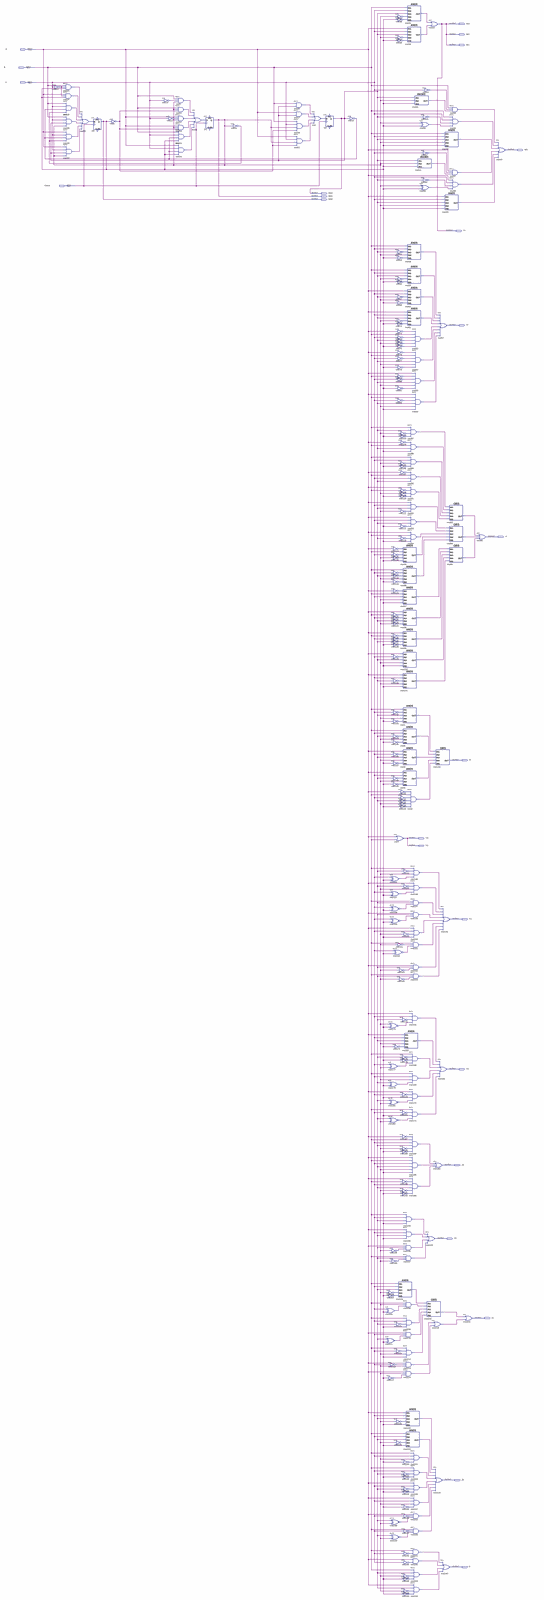
[diagram p0: schematic sheet, whole]
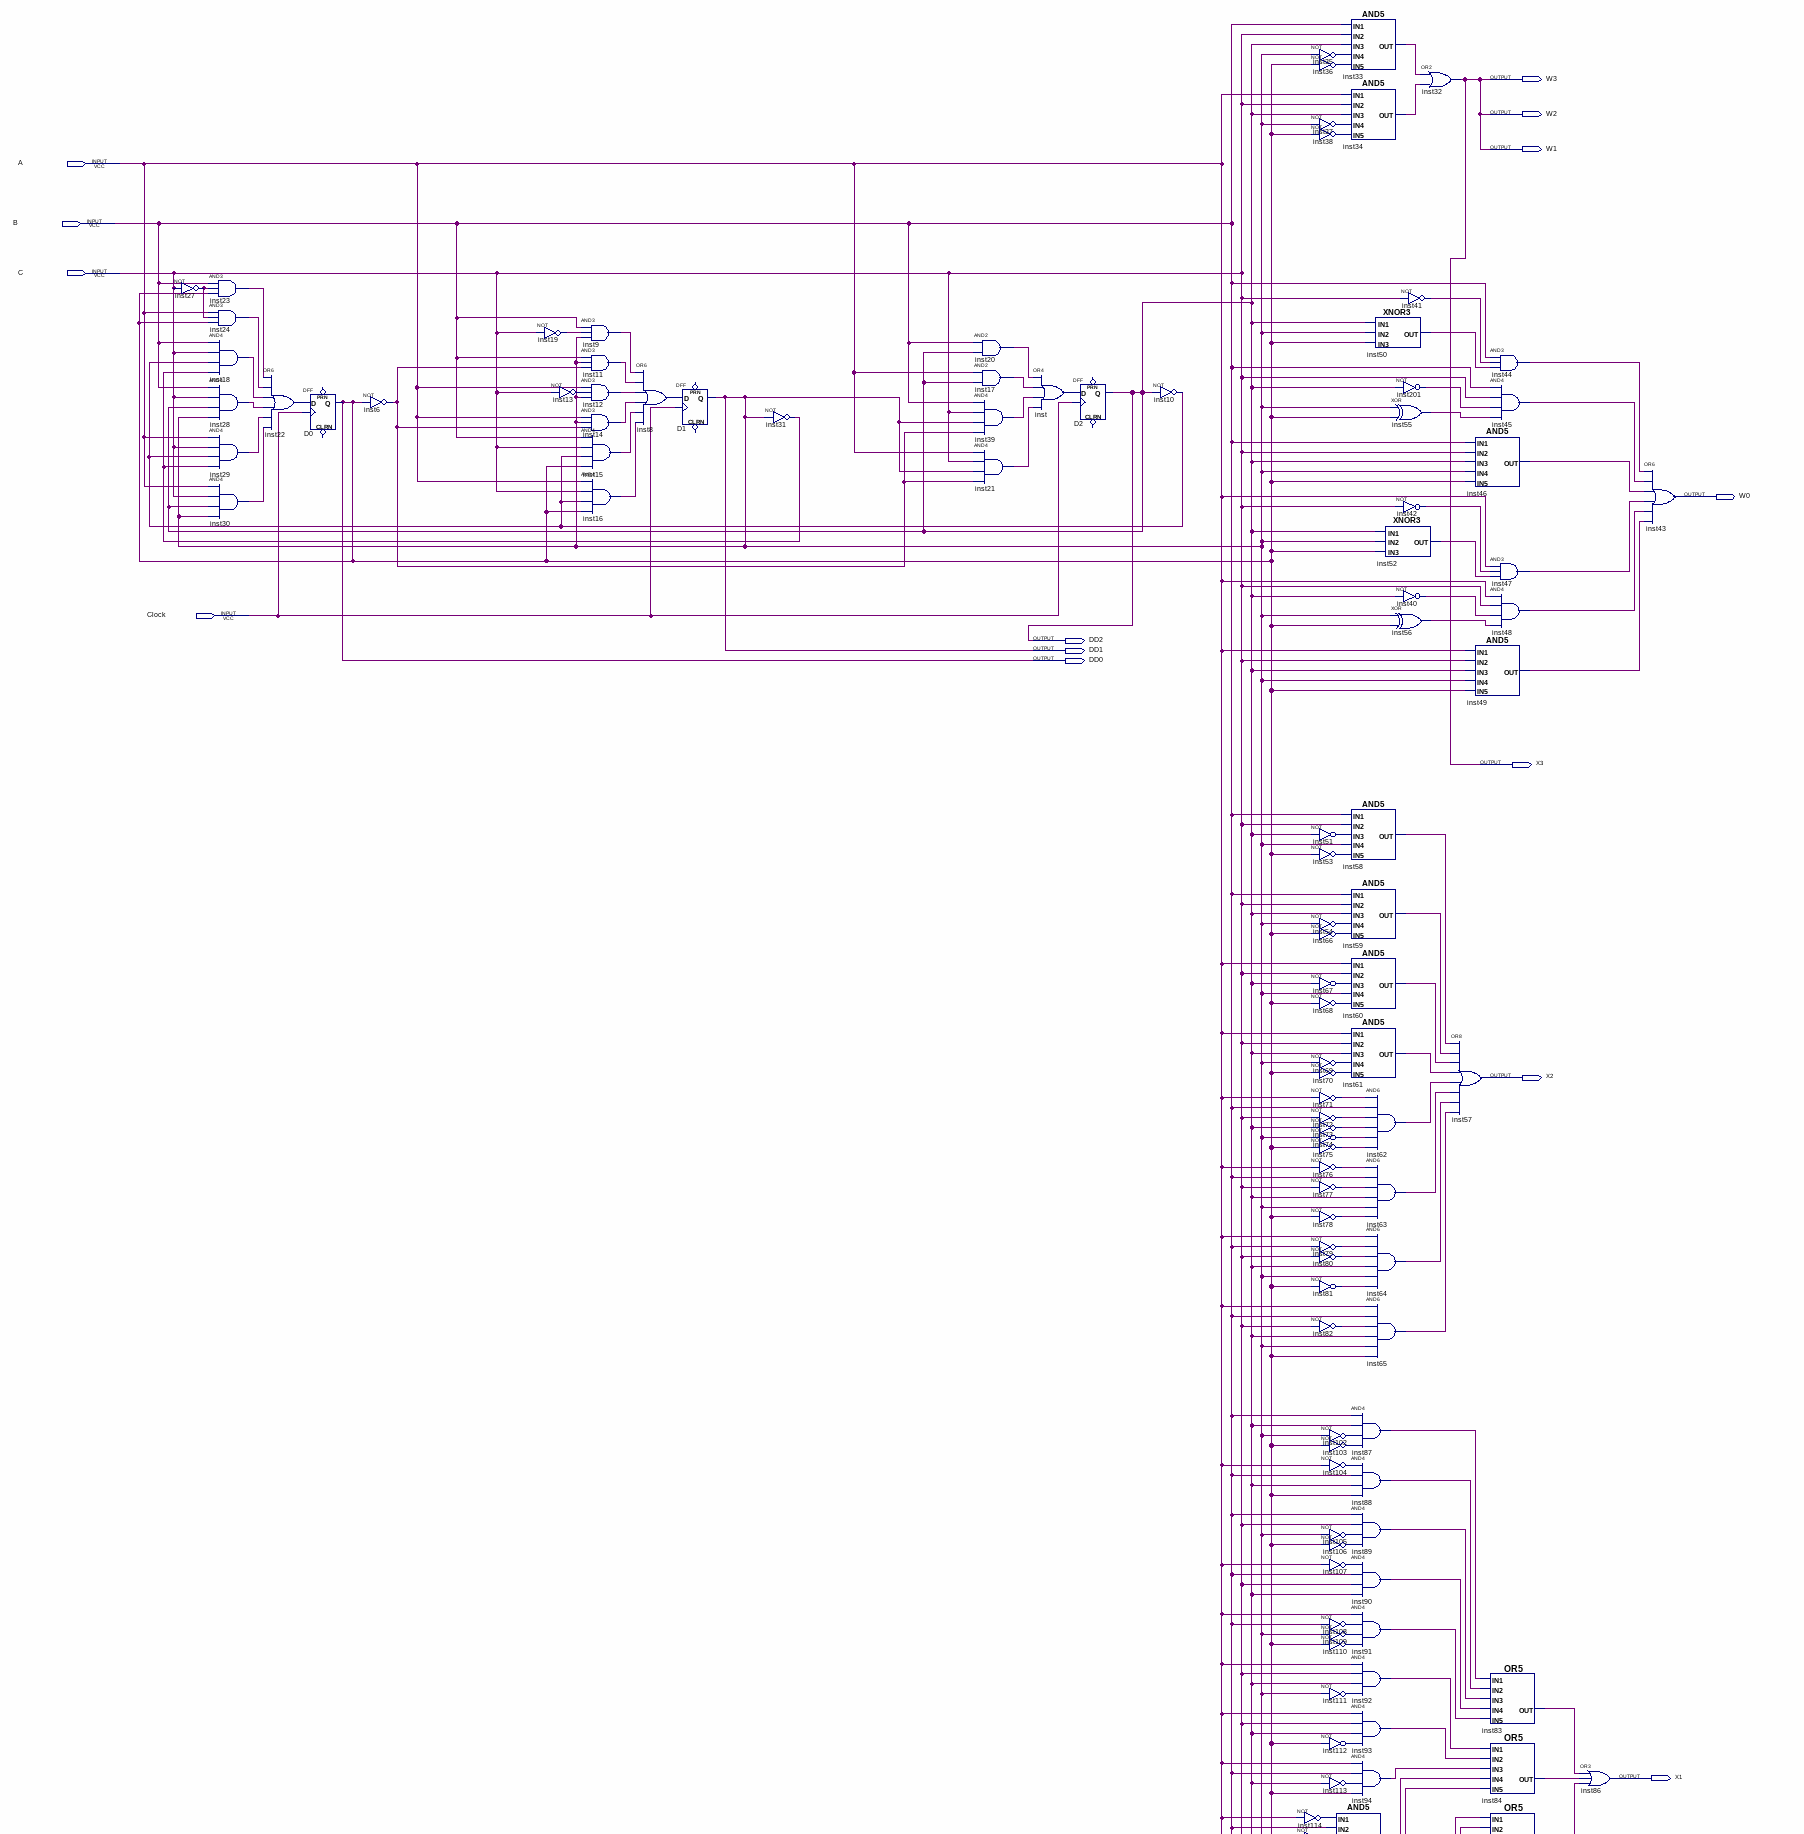
[diagram p1: schematic sheet, upper part]
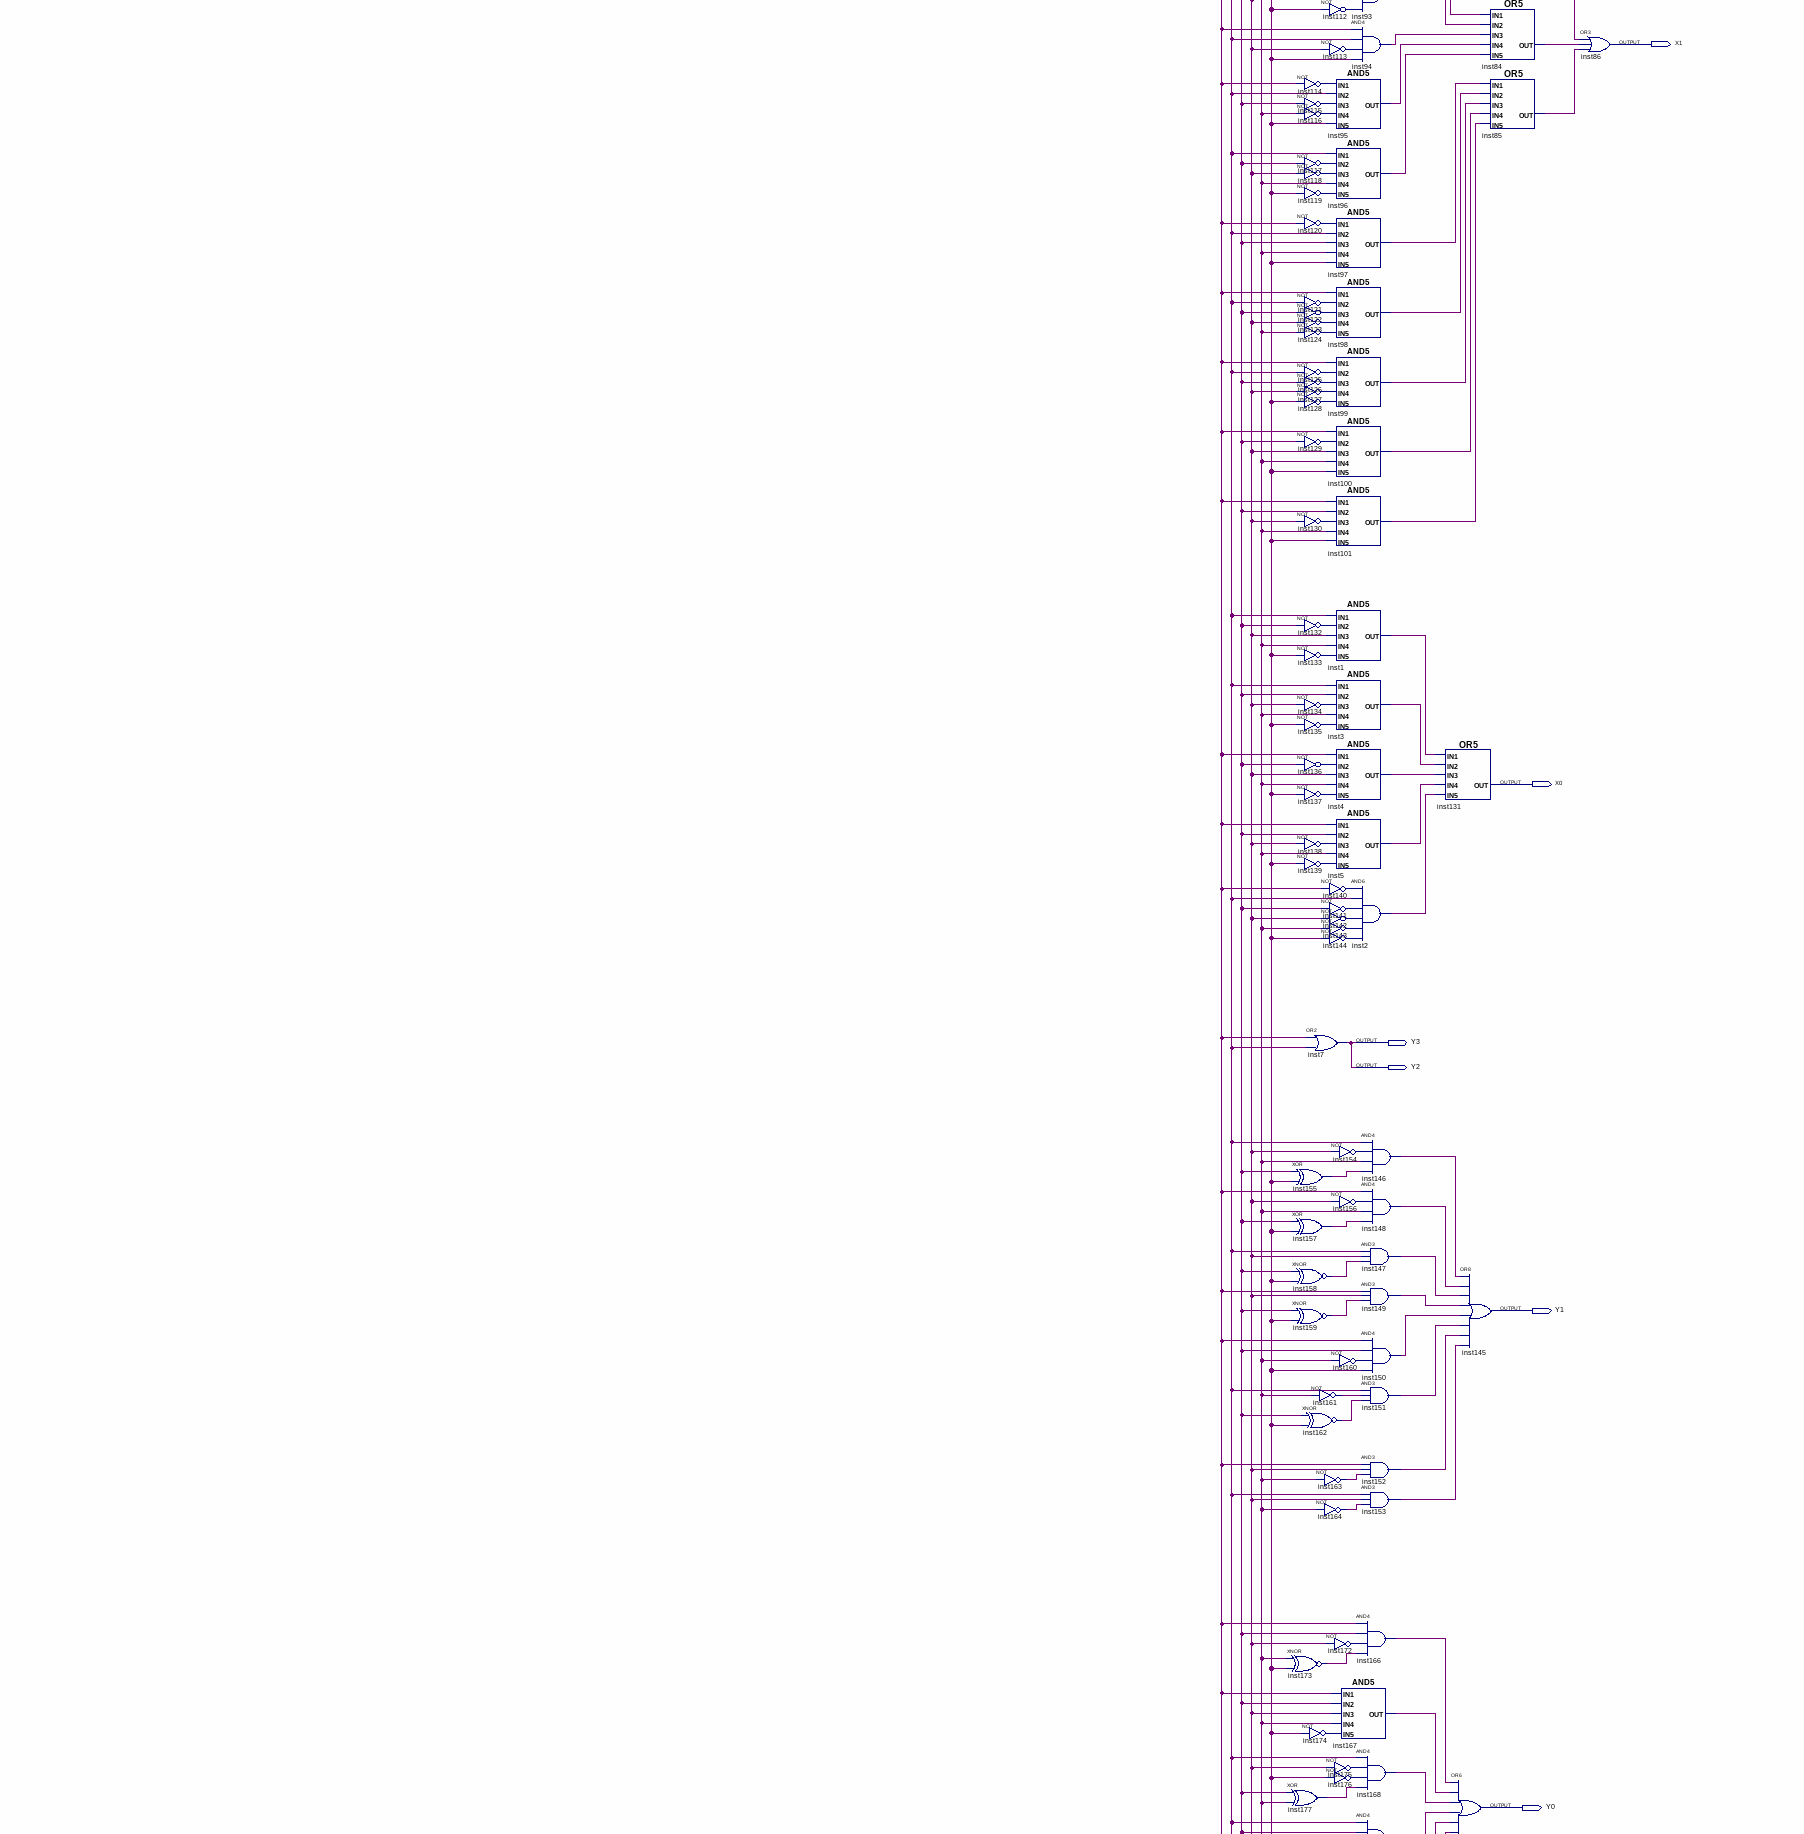
[diagram p2: schematic sheet, middle part]
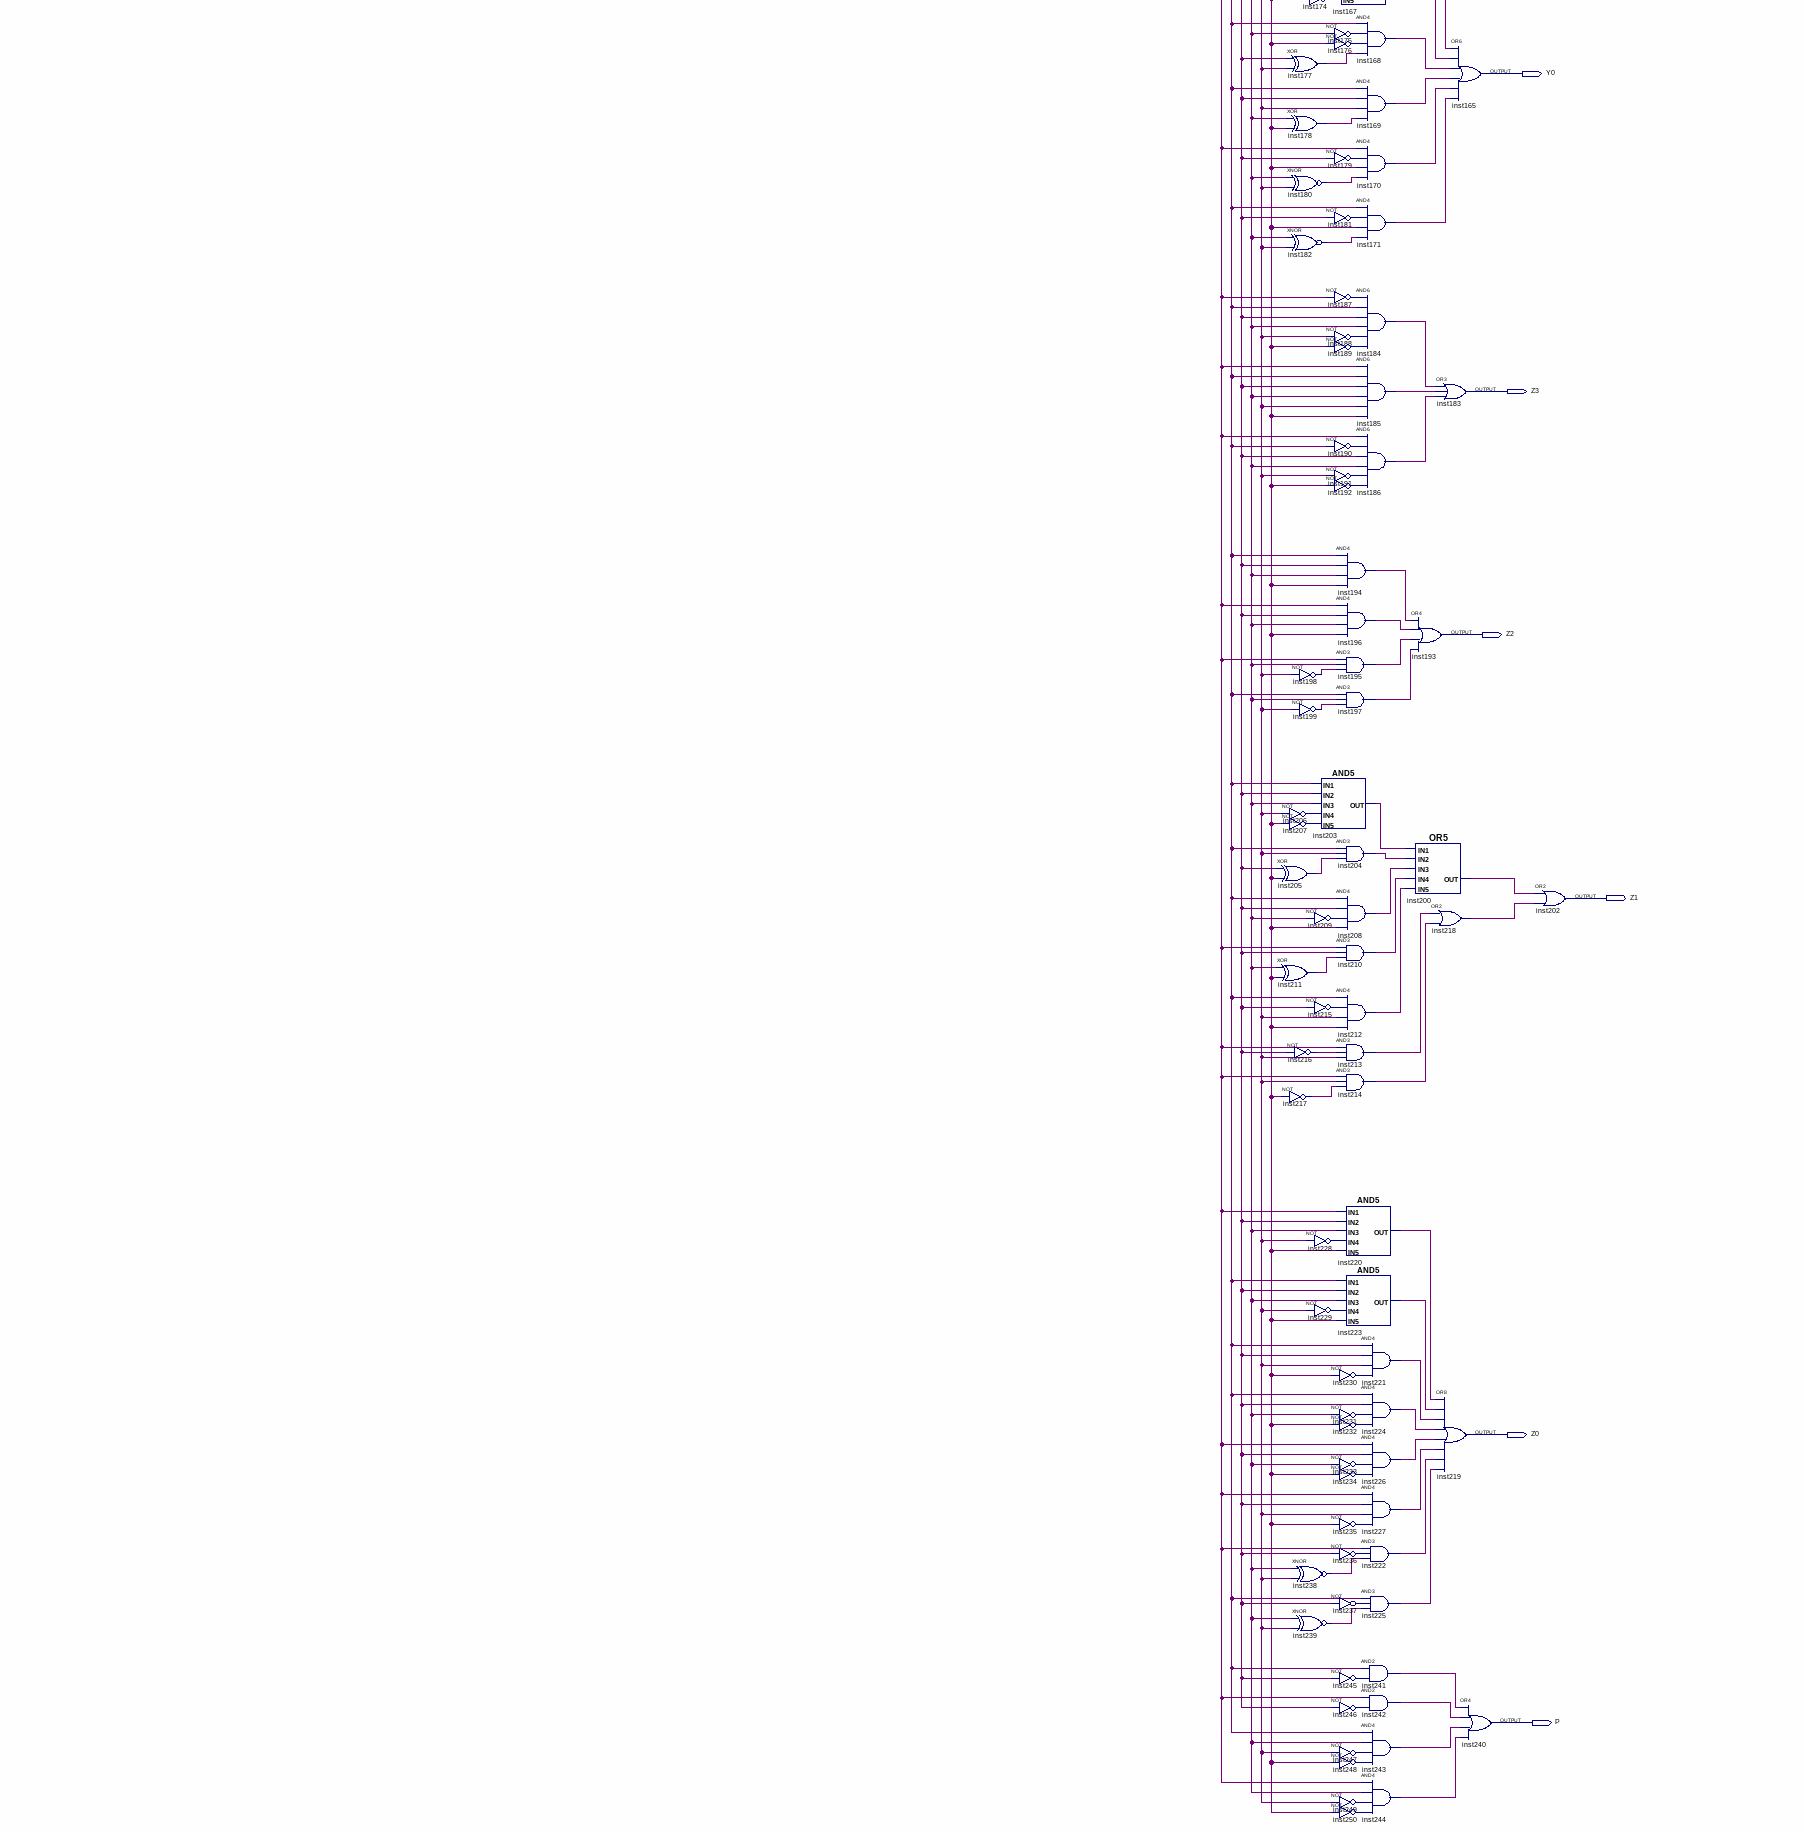
[diagram p3: schematic sheet, lower part]
// Quartus schematic MaquinaEstados.bdf as structural Verilog: 252 symbols, 24 pins
module MaquinaEstados (
  input  A,
  input  B,
  input  C,
  input  Clock,
  output W3,
  output W2,
  output W1,
  output W0,
  output DD2,
  output DD1,
  output DD0,
  output X3,
  output X2,
  output X1,
  output X0,
  output Y3,
  output Y2,
  output Y1,
  output Y0,
  output Z3,
  output Z2,
  output Z1,
  output Z0,
  output P
);

  wire inst1_out, inst2_out, inst3_out, inst4_out, inst5_out, inst6_out, inst8_out, inst9_out, inst10_out,
       inst11_out, inst12_out, inst13_out, inst14_out, inst15_out, inst16_out, inst17_out, inst18_out,
       inst19_out, inst20_out, inst21_out, inst22_out, inst23_out, inst24_out, inst27_out, inst28_out,
       inst29_out, inst30_out, inst31_out, inst33_out, inst34_out, inst35_out, inst36_out, inst37_out,
       inst38_out, inst39_out, inst40_out, inst41_out, inst42_out, inst44_out, inst45_out, inst46_out,
       inst47_out, inst48_out, inst49_out, inst50_out, inst51_out, inst52_out, inst53_out, inst54_out,
       inst55_out, inst56_out, inst58_out, inst59_out, inst60_out, inst61_out, inst62_out, inst63_out,
       inst64_out, inst65_out, inst66_out, inst67_out, inst68_out, inst69_out, inst70_out, inst71_out,
       inst72_out, inst73_out, inst74_out, inst75_out, inst76_out, inst77_out, inst78_out, inst79_out,
       inst80_out, inst81_out, inst82_out, inst83_out, inst84_out, inst85_out, inst87_out, inst88_out,
       inst89_out, inst90_out, inst91_out, inst92_out, inst93_out, inst94_out, inst95_out, inst96_out,
       inst97_out, inst98_out, inst99_out, inst100_out, inst101_out, inst102_out, inst103_out, inst104_out,
       inst105_out, inst106_out, inst107_out, inst108_out, inst109_out, inst110_out, inst111_out,
       inst112_out, inst113_out, inst114_out, inst115_out, inst116_out, inst117_out, inst118_out,
       inst119_out, inst120_out, inst121_out, inst122_out, inst123_out, inst124_out, inst125_out,
       inst126_out, inst127_out, inst128_out, inst129_out, inst130_out, inst132_out, inst133_out,
       inst134_out, inst135_out, inst136_out, inst137_out, inst138_out, inst139_out, inst140_out,
       inst141_out, inst142_out, inst143_out, inst144_out, inst146_out, inst147_out, inst148_out,
       inst149_out, inst150_out, inst151_out, inst152_out, inst153_out, inst154_out, inst155_out,
       inst156_out, inst157_out, inst158_out, inst159_out, inst160_out, inst161_out, inst162_out,
       inst163_out, inst164_out, inst166_out, inst167_out, inst168_out, inst169_out, inst170_out,
       inst171_out, inst172_out, inst173_out, inst174_out, inst175_out, inst176_out, inst177_out,
       inst178_out, inst179_out, inst180_out, inst181_out, inst182_out, inst184_out, inst185_out,
       inst186_out, inst187_out, inst188_out, inst189_out, inst190_out, inst191_out, inst192_out,
       inst194_out, inst195_out, inst196_out, inst197_out, inst198_out, inst199_out, inst200_out,
       inst201_out, inst203_out, inst204_out, inst205_out, inst206_out, inst207_out, inst208_out,
       inst209_out, inst210_out, inst211_out, inst212_out, inst213_out, inst214_out, inst215_out,
       inst216_out, inst217_out, inst218_out, inst220_out, inst221_out, inst222_out, inst223_out,
       inst224_out, inst225_out, inst226_out, inst227_out, inst228_out, inst229_out, inst230_out,
       inst231_out, inst232_out, inst233_out, inst234_out, inst235_out, inst236_out, inst237_out,
       inst238_out, inst239_out, inst241_out, inst242_out, inst243_out, inst244_out, inst245_out,
       inst246_out, inst247_out, inst248_out, inst249_out, inst250_out, inst_out;

  not inst27 (inst27_out, C);
  and inst23 (inst23_out, B, inst27_out, DD0);
  and inst24 (inst24_out, A, inst27_out, DD0);
  and inst18 (inst18_out, B, C, inst10_out, inst31_out);
  and inst28 (inst28_out, B, C, DD2, DD1);
  and inst29 (inst29_out, A, C, inst10_out, inst31_out);
  and inst30 (inst30_out, A, C, DD2, DD1);
  or inst22 (inst22_out, inst23_out, inst24_out, inst18_out, inst28_out, inst29_out, inst30_out);
  DFF D0 (.CLK(Clock), .D(inst22_out), .Q(DD0));  // open: CLRN, PRN
  not inst6 (inst6_out, DD0);
  not inst19 (inst19_out, C);
  not inst13 (inst13_out, C);
  and inst9 (inst9_out, B, inst19_out, DD1);
  and inst11 (inst11_out, B, DD1, inst6_out);
  and inst12 (inst12_out, A, inst13_out, DD1);
  and inst14 (inst14_out, A, DD1, inst6_out);
  and inst15 (inst15_out, B, C, inst10_out, DD0);
  and inst16 (inst16_out, A, C, inst10_out, DD0);
  or inst8 (inst8_out, inst9_out, inst11_out, inst12_out, inst14_out, inst15_out, inst16_out);
  DFF D1 (.CLK(Clock), .D(inst8_out), .Q(DD1));  // open: CLRN, PRN
  not inst31 (inst31_out, DD1);
  and inst20 (inst20_out, B, DD2);
  and inst17 (inst17_out, A, DD2);
  and inst39 (inst39_out, B, C, DD1, inst6_out);
  and inst21 (inst21_out, A, C, DD1, inst6_out);
  or inst (inst_out, inst20_out, inst17_out, inst39_out, inst21_out);
  DFF D2 (.CLK(Clock), .D(inst_out), .Q(DD2));  // open: CLRN, PRN
  not inst10 (inst10_out, DD2);
  not inst114 (inst114_out, A);
  not inst115 (inst115_out, C);
  not inst116 (inst116_out, DD1);
  not inst117 (inst117_out, C);
  not inst118 (inst118_out, DD2);
  not inst119 (inst119_out, DD0);
  not inst120 (inst120_out, A);
  not inst121 (inst121_out, B);
  not inst122 (inst122_out, C);
  not inst123 (inst123_out, DD2);
  not inst124 (inst124_out, DD1);
  not inst125 (inst125_out, B);
  not inst126 (inst126_out, C);
  not inst127 (inst127_out, DD2);
  not inst128 (inst128_out, DD0);
  not inst129 (inst129_out, C);
  not inst130 (inst130_out, DD2);
  not inst132 (inst132_out, C);
  not inst133 (inst133_out, DD0);
  not inst134 (inst134_out, DD2);
  not inst135 (inst135_out, DD0);
  not inst136 (inst136_out, C);
  not inst137 (inst137_out, DD0);
  not inst138 (inst138_out, DD2);
  not inst139 (inst139_out, DD0);
  or inst7 (Y2, A, B);
  xor inst155 (inst155_out, C, DD0);
  xor inst157 (inst157_out, C, DD0);
  xnor inst158 (inst158_out, C, DD0);
  xnor inst159 (inst159_out, C, DD0);
  xnor inst162 (inst162_out, C, DD0);
  xnor inst173 (inst173_out, DD1, DD0);
  not inst174 (inst174_out, DD0);
  xor inst177 (inst177_out, C, DD1);
  xor inst178 (inst178_out, DD2, DD0);
  xnor inst180 (inst180_out, DD2, DD1);
  xnor inst182 (inst182_out, DD2, DD1);
  not inst198 (inst198_out, DD1);
  not inst199 (inst199_out, DD1);
  not inst206 (inst206_out, DD1);
  not inst207 (inst207_out, DD0);
  xor inst205 (inst205_out, C, DD0);
  not inst209 (inst209_out, DD2);
  xor inst211 (inst211_out, DD2, DD0);
  not inst215 (inst215_out, C);
  not inst216 (inst216_out, C);
  not inst217 (inst217_out, DD0);
  not inst228 (inst228_out, DD1);
  not inst229 (inst229_out, DD1);
  xnor inst238 (inst238_out, DD2, DD1);
  xnor inst239 (inst239_out, DD2, DD1);
  and inst33 (inst33_out, B, C, DD2, inst35_out, inst36_out);
  not inst35 (inst35_out, DD1);
  not inst36 (inst36_out, DD0);
  and inst34 (inst34_out, A, C, DD2, inst37_out, inst38_out);
  not inst37 (inst37_out, DD1);
  not inst38 (inst38_out, DD0);
  and inst58 (inst58_out, B, C, inst51_out, DD1, inst53_out);
  not inst51 (inst51_out, DD2);
  not inst53 (inst53_out, DD0);
  and inst59 (inst59_out, B, C, DD2, inst54_out, inst66_out);
  not inst54 (inst54_out, DD1);
  not inst66 (inst66_out, DD0);
  and inst60 (inst60_out, A, C, inst67_out, DD1, inst68_out);
  not inst67 (inst67_out, DD2);
  not inst68 (inst68_out, DD0);
  and inst61 (inst61_out, A, C, DD2, inst69_out, inst70_out);
  not inst69 (inst69_out, DD1);
  not inst70 (inst70_out, DD0);
  not inst71 (inst71_out, A);
  not inst72 (inst72_out, C);
  not inst73 (inst73_out, DD2);
  not inst74 (inst74_out, DD1);
  not inst75 (inst75_out, DD0);
  not inst76 (inst76_out, A);
  not inst77 (inst77_out, C);
  not inst78 (inst78_out, DD0);
  not inst79 (inst79_out, B);
  not inst80 (inst80_out, C);
  not inst81 (inst81_out, DD0);
  not inst82 (inst82_out, C);
  not inst102 (inst102_out, DD1);
  not inst103 (inst103_out, DD0);
  not inst104 (inst104_out, A);
  not inst105 (inst105_out, DD1);
  not inst106 (inst106_out, DD0);
  not inst107 (inst107_out, A);
  not inst108 (inst108_out, B);
  not inst109 (inst109_out, DD1);
  not inst110 (inst110_out, DD0);
  not inst111 (inst111_out, DD1);
  not inst112 (inst112_out, DD0);
  not inst113 (inst113_out, DD2);
  and inst95 (inst95_out, inst114_out, B, inst115_out, inst116_out, DD0);
  and inst96 (inst96_out, B, inst117_out, inst118_out, DD1, inst119_out);
  and inst97 (inst97_out, inst120_out, B, C, DD1, DD0);
  and inst98 (inst98_out, A, inst121_out, inst122_out, inst123_out, inst124_out);
  and inst99 (inst99_out, A, inst125_out, inst126_out, inst127_out, inst128_out);
  and inst100 (inst100_out, A, inst129_out, DD2, DD1, DD0);
  and inst101 (inst101_out, A, C, inst130_out, DD1, DD0);
  and inst1 (inst1_out, B, inst132_out, DD2, DD1, inst133_out);
  and inst3 (inst3_out, B, C, inst134_out, DD1, inst135_out);
  and inst4 (inst4_out, A, inst136_out, DD2, DD1, inst137_out);
  and inst5 (inst5_out, A, C, inst138_out, DD1, inst139_out);
  not inst140 (inst140_out, A);
  not inst141 (inst141_out, C);
  not inst142 (inst142_out, DD2);
  not inst143 (inst143_out, DD1);
  not inst144 (inst144_out, DD0);
  not inst154 (inst154_out, DD2);
  not inst156 (inst156_out, DD2);
  not inst160 (inst160_out, DD1);
  not inst161 (inst161_out, DD1);
  not inst163 (inst163_out, DD1);
  not inst164 (inst164_out, DD1);
  not inst172 (inst172_out, DD2);
  and inst167 (inst167_out, A, C, DD2, DD1, inst174_out);
  not inst175 (inst175_out, DD2);
  not inst176 (inst176_out, DD0);
  not inst179 (inst179_out, C);
  not inst181 (inst181_out, C);
  not inst187 (inst187_out, A);
  not inst188 (inst188_out, DD1);
  not inst189 (inst189_out, DD0);
  not inst190 (inst190_out, B);
  not inst191 (inst191_out, DD1);
  not inst192 (inst192_out, DD0);
  and inst194 (inst194_out, B, C, DD2, DD0);
  and inst196 (inst196_out, A, C, DD2, DD0);
  and inst195 (inst195_out, A, DD2, inst198_out);
  and inst197 (inst197_out, B, DD2, inst199_out);
  and inst203 (inst203_out, B, C, DD2, inst206_out, inst207_out);
  and inst204 (inst204_out, B, DD1, inst205_out);
  and inst208 (inst208_out, B, C, inst209_out, DD0);
  and inst210 (inst210_out, A, C, inst211_out);
  and inst212 (inst212_out, B, inst215_out, DD1, DD0);
  and inst213 (inst213_out, A, inst216_out, DD1);
  and inst214 (inst214_out, A, DD1, inst217_out);
  and inst220 (inst220_out, A, C, DD2, inst228_out, DD0);
  and inst223 (inst223_out, B, C, DD2, inst229_out, DD0);
  not inst230 (inst230_out, DD0);
  not inst231 (inst231_out, DD2);
  not inst232 (inst232_out, DD0);
  not inst233 (inst233_out, DD2);
  not inst234 (inst234_out, DD0);
  not inst235 (inst235_out, DD0);
  not inst236 (inst236_out, C);
  not inst237 (inst237_out, C);
  not inst245 (inst245_out, C);
  not inst246 (inst246_out, C);
  not inst247 (inst247_out, DD1);
  not inst248 (inst248_out, DD0);
  not inst249 (inst249_out, DD1);
  not inst250 (inst250_out, DD0);
  XNOR3 inst50 (.IN3(DD0), .IN2(DD1), .IN1(DD2), .OUT(inst50_out));
  XNOR3 inst52 (.IN3(DD0), .IN2(DD1), .IN1(DD2), .OUT(inst52_out));
  and inst62 (inst62_out, inst71_out, B, inst72_out, inst73_out, inst74_out, inst75_out);
  and inst63 (inst63_out, inst76_out, B, inst77_out, DD2, DD1, inst78_out);
  and inst64 (inst64_out, A, inst79_out, inst80_out, DD2, DD1, inst81_out);
  and inst65 (inst65_out, A, B, inst82_out, DD2, DD1, DD0);
  and inst87 (inst87_out, B, DD2, inst102_out, inst103_out);
  and inst88 (inst88_out, inst104_out, B, DD2, DD0);
  and inst89 (inst89_out, B, C, inst105_out, inst106_out);
  and inst90 (inst90_out, inst107_out, B, C, DD2);
  and inst91 (inst91_out, A, inst108_out, inst109_out, inst110_out);
  and inst92 (inst92_out, A, C, DD2, inst111_out);
  and inst93 (inst93_out, A, C, DD2, inst112_out);
  and inst94 (inst94_out, A, B, inst113_out, DD0);
  and inst2 (inst2_out, inst140_out, B, inst141_out, inst142_out, inst143_out, inst144_out);
  and inst146 (inst146_out, B, inst154_out, DD1, inst155_out);
  and inst148 (inst148_out, A, inst156_out, DD1, inst157_out);
  and inst147 (inst147_out, B, DD2, inst158_out);
  and inst149 (inst149_out, A, DD2, inst159_out);
  and inst150 (inst150_out, A, C, inst160_out, DD0);
  and inst151 (inst151_out, B, inst161_out, inst162_out);
  and inst152 (inst152_out, A, DD2, inst163_out);
  and inst153 (inst153_out, B, DD2, inst164_out);
  and inst166 (inst166_out, A, C, inst172_out, inst173_out);
  and inst168 (inst168_out, B, inst175_out, inst176_out, inst177_out);
  and inst169 (inst169_out, B, C, DD1, inst178_out);
  and inst170 (inst170_out, A, inst179_out, DD0, inst180_out);
  and inst171 (inst171_out, B, inst181_out, DD0, inst182_out);
  and inst184 (inst184_out, inst187_out, B, C, DD2, inst188_out, inst189_out);
  and inst185 (inst185_out, A, B, C, DD2, DD1, DD0);
  and inst186 (inst186_out, A, inst190_out, C, DD2, inst191_out, inst192_out);
  and inst221 (inst221_out, B, C, DD1, inst230_out);
  and inst224 (inst224_out, B, C, inst231_out, inst232_out);
  and inst226 (inst226_out, A, C, inst233_out, inst234_out);
  and inst227 (inst227_out, A, C, DD1, inst235_out);
  and inst222 (inst222_out, A, inst236_out, inst238_out);
  and inst225 (inst225_out, B, inst237_out, inst239_out);
  and inst241 (inst241_out, B, inst245_out);
  and inst242 (inst242_out, A, inst246_out);
  and inst243 (inst243_out, B, DD2, inst247_out, inst248_out);
  and inst244 (inst244_out, A, DD2, inst249_out, inst250_out);
  or inst32 (W1, inst33_out, inst34_out);
  not inst41 (inst41_out, C);
  not inst201 (inst201_out, DD2);
  xor inst55 (inst55_out, DD1, DD0);
  not inst42 (inst42_out, C);
  not inst40 (inst40_out, DD2);
  xor inst56 (inst56_out, DD1, DD0);
  or inst193 (Z2, inst194_out, inst196_out, inst195_out, inst197_out);
  or inst200 (inst200_out, inst203_out, inst204_out, inst208_out, inst210_out, inst212_out);
  and inst46 (inst46_out, B, C, DD2, DD1, DD0);
  and inst49 (inst49_out, A, C, DD2, DD1, DD0);
  or inst57 (X2, inst58_out, inst59_out, inst60_out, inst61_out, inst62_out, inst63_out, inst64_out, inst65_out);
  or inst131 (X0, inst1_out, inst3_out, inst4_out, inst5_out, inst2_out);
  or inst145 (Y1, inst146_out, inst148_out, inst147_out, inst149_out, inst150_out, inst151_out, inst152_out, inst153_out);
  or inst165 (Y0, inst166_out, inst167_out, inst168_out, inst169_out, inst170_out, inst171_out);
  or inst183 (Z3, inst184_out, inst185_out, inst186_out);
  or inst218 (inst218_out, inst213_out, inst214_out);
  or inst219 (Z0, inst220_out, inst223_out, inst221_out, inst224_out, inst226_out, inst227_out, inst222_out, inst225_out);
  or inst240 (P, inst241_out, inst242_out, inst243_out, inst244_out);
  and inst44 (inst44_out, B, inst41_out, inst50_out);
  and inst45 (inst45_out, B, C, inst201_out, inst55_out);
  and inst47 (inst47_out, A, inst42_out, inst52_out);
  and inst48 (inst48_out, A, C, inst40_out, inst56_out);
  or inst83 (inst83_out, inst87_out, inst88_out, inst89_out, inst90_out, inst91_out);
  or inst84 (inst84_out, inst92_out, inst93_out, inst94_out, inst95_out, inst96_out);
  or inst85 (inst85_out, inst97_out, inst98_out, inst99_out, inst100_out, inst101_out);
  or inst202 (Z1, inst200_out, inst218_out);
  or inst86 (X1, inst83_out, inst84_out, inst85_out);
  or inst43 (W0, inst44_out, inst45_out, inst46_out, inst47_out, inst48_out, inst49_out);

  assign W2 = W1;
  assign W3 = W1;
  assign X3 = W1;
  assign Y3 = Y2;
endmodule
